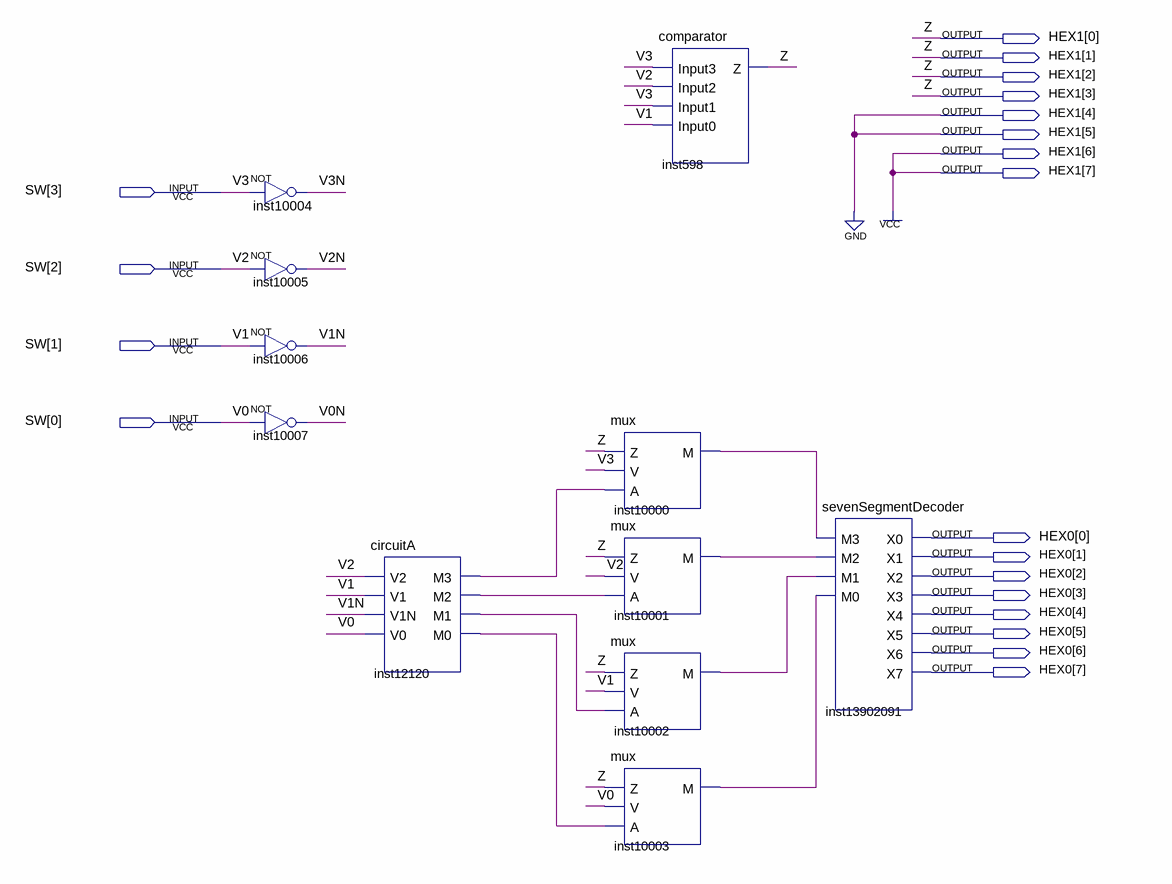
[diagram p0: schematic sheet]
// Quartus schematic lab3.bdf as structural Verilog: 11 symbols, 20 pins
module lab3 (
  input  [3:0] SW,
  output [7:0] HEX1,
  output [7:0] HEX0
);

  wire inst10000_m, inst10001_m, inst10002_m, inst10003_m, inst12120_m0, inst12120_m1, inst12120_m2,
       inst12120_m3, V0N, V1N, V2N, V3N;

  not inst10004 (V3N, SW[3]);
  not inst10005 (V2N, SW[2]);
  not inst10006 (V1N, SW[1]);
  not inst10007 (V0N, SW[0]);
  circuitA inst12120 (
    .V2(SW[2]), .V1(SW[1]), .V1N(V1N), .V0(SW[0]), .M3(inst12120_m3), .M2(inst12120_m2), .M1(inst12120_m1),
    .M0(inst12120_m0));
  mux inst10000 (.Z(HEX1[3]), .V(SW[3]), .A(inst12120_m3), .M(inst10000_m));
  mux inst10001 (.Z(HEX1[3]), .V(SW[2]), .A(inst12120_m2), .M(inst10001_m));
  mux inst10002 (.Z(HEX1[3]), .V(SW[1]), .A(inst12120_m1), .M(inst10002_m));
  mux inst10003 (.Z(HEX1[3]), .V(SW[0]), .A(inst12120_m0), .M(inst10003_m));
  comparator inst598 (.Input3(SW[3]), .Input2(SW[2]), .Input1(SW[3]), .Input0(SW[1]), .Z(HEX1[3]));
  sevenSegmentDecoder inst13902091 (
    .M3(inst10000_m), .M2(inst10001_m), .M1(inst10002_m), .M0(inst10003_m), .X0(HEX0[0]), .X1(HEX0[1]),
    .X2(HEX0[2]), .X3(HEX0[3]), .X4(HEX0[4]), .X5(HEX0[5]), .X6(HEX0[6]), .X7(HEX0[7]));

  assign {HEX1[7:4], HEX1[2:0]} = {4'b1100, {3{HEX1[3]}}};

  // Other names for the same wires on the sheet: V0 = SW[0]; V1 = SW[1]; V2 = SW[2]; V3 = SW[3]; Z = HEX1[3]
endmodule
